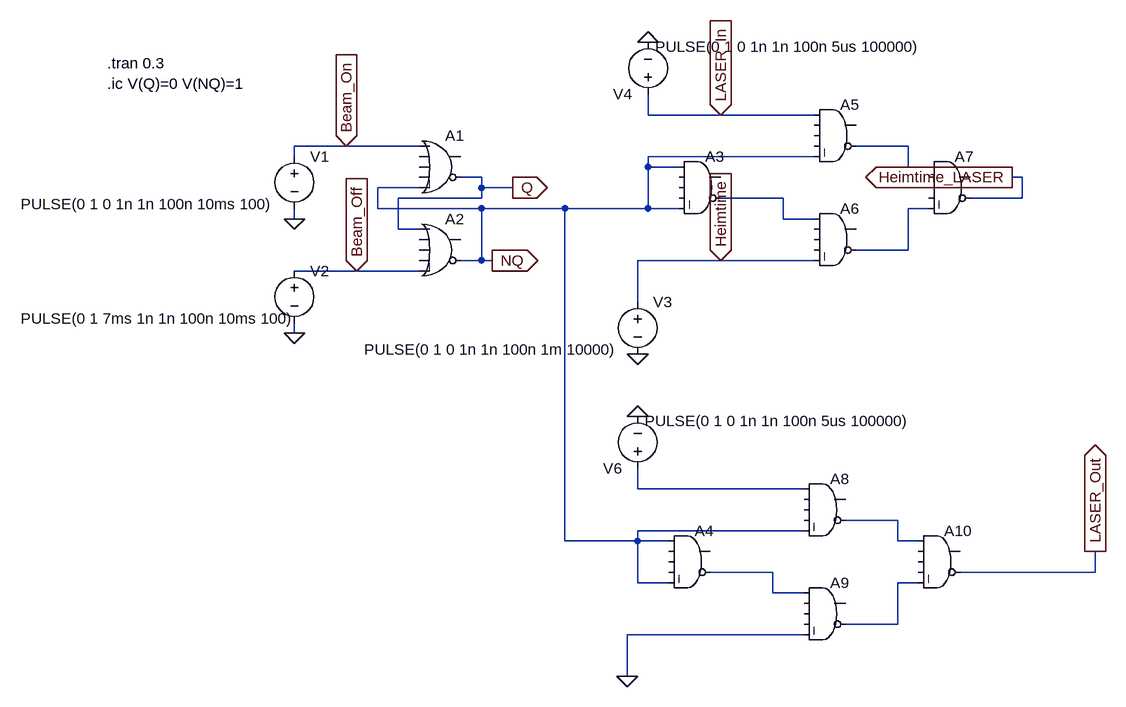
[diagram p0: schematic Draft1.asc]
Draft1.asc, the LTspice schematic file:
Version 4
SHEET 1 1288 1028
WIRE 528 64 528 32
WIRE 640 64 528 64
WIRE 784 64 640 64
WIRE 64 112 -16 112
WIRE 176 112 64 112
WIRE 928 112 848 112
WIRE -16 128 -16 112
WIRE 784 128 528 128
WIRE 528 144 528 128
WIRE 576 144 528 144
WIRE 928 144 928 112
WIRE 960 144 928 144
WIRE 272 160 240 160
WIRE 1104 160 1088 160
WIRE 176 176 112 176
WIRE 272 176 272 160
WIRE 320 176 272 176
WIRE 272 192 272 176
WIRE 272 192 144 192
WIRE 736 192 640 192
WIRE 1104 192 1104 160
WIRE 1104 192 1024 192
WIRE 112 208 112 176
WIRE 272 208 112 208
WIRE 400 208 272 208
WIRE 528 208 528 144
WIRE 528 208 400 208
WIRE 576 208 528 208
WIRE 960 208 928 208
WIRE -16 224 -16 208
WIRE 736 224 736 192
WIRE 784 224 736 224
WIRE 144 240 144 192
WIRE 176 240 144 240
WIRE 928 272 928 208
WIRE 928 272 848 272
WIRE 272 288 272 208
WIRE 272 288 240 288
WIRE 288 288 272 288
WIRE 640 288 512 288
WIRE 784 288 640 288
WIRE 80 304 -16 304
WIRE 176 304 80 304
WIRE 512 352 512 288
WIRE -16 400 -16 384
WIRE 512 640 512 608
WIRE 768 640 512 640
WIRE 912 688 832 688
WIRE 768 704 512 704
WIRE 400 720 400 208
WIRE 512 720 512 704
WIRE 512 720 400 720
WIRE 560 720 512 720
WIRE 912 720 912 688
WIRE 944 720 912 720
WIRE 720 768 624 768
WIRE 1216 768 1216 736
WIRE 1216 768 1008 768
WIRE 512 784 512 720
WIRE 560 784 512 784
WIRE 944 784 912 784
WIRE 720 800 720 768
WIRE 768 800 720 800
WIRE 912 848 912 784
WIRE 912 848 832 848
WIRE 768 864 496 864
WIRE 496 928 496 864
FLAG -16 224 0
FLAG -16 400 0
FLAG 320 176 Q
IOPIN 320 176 Out
FLAG 288 288 NQ
IOPIN 288 288 Out
FLAG 512 432 0
FLAG 528 -48 0
FLAG 1088 160 Heimtime_LASER
IOPIN 1088 160 Out
FLAG 512 528 0
FLAG 1216 736 LASER_Out
IOPIN 1216 736 Out
FLAG 496 928 0
FLAG 640 64 LASER_In
IOPIN 640 64 In
FLAG 640 288 Heimtime
IOPIN 640 288 In
FLAG 64 112 Beam_On
IOPIN 64 112 In
FLAG 80 304 Beam_Off
IOPIN 80 304 In
SYMBOL Digital\\or 208 80 R0
SYMATTR InstName A1
SYMBOL voltage -16 112 R0
WINDOW 3 -421 89 Left 2
WINDOW 123 0 0 Left 0
WINDOW 39 0 0 Left 0
SYMATTR InstName V1
SYMATTR Value PULSE(0 1 0 1n 1n 100n 10ms 100)
SYMBOL voltage -16 288 R0
WINDOW 3 -421 89 Left 2
WINDOW 123 0 0 Left 0
WINDOW 39 0 0 Left 0
SYMATTR InstName V2
SYMATTR Value PULSE(0 1 7ms 1n 1n 100n 10ms 100)
SYMBOL Digital\\or 208 208 R0
SYMATTR InstName A2
SYMBOL Digital\\and 608 112 R0
SYMATTR InstName A3
SYMBOL Digital\\and 816 32 R0
SYMATTR InstName A5
SYMBOL Digital\\and 816 192 R0
SYMATTR InstName A6
SYMBOL Digital\\and 992 112 R0
SYMATTR InstName A7
SYMBOL voltage 512 336 R0
WINDOW 3 -421 89 Left 2
WINDOW 123 0 0 Left 0
WINDOW 39 0 0 Left 0
SYMATTR InstName V3
SYMATTR Value PULSE(0 1 0 1n 1n 100n 1m 10000)
SYMBOL voltage 528 48 R180
WINDOW 3 -421 89 Left 2
WINDOW 123 0 0 Left 0
WINDOW 39 0 0 Left 0
SYMATTR InstName V4
SYMATTR Value PULSE(0 1 0 1n 1n 100n 5us 100000)
SYMBOL Digital\\and 592 688 R0
SYMATTR InstName A4
SYMBOL Digital\\and 800 608 R0
SYMATTR InstName A8
SYMBOL Digital\\and 800 768 R0
SYMATTR InstName A9
SYMBOL Digital\\and 976 688 R0
SYMATTR InstName A10
SYMBOL voltage 512 624 R180
WINDOW 3 -421 89 Left 2
WINDOW 123 0 0 Left 0
WINDOW 39 0 0 Left 0
SYMATTR InstName V6
SYMATTR Value PULSE(0 1 0 1n 1n 100n 5us 100000)
TEXT -304 -16 Left 2 !.tran 0.3
TEXT -304 16 Left 2 !.ic V(Q)=0 V(NQ)=1

The netlist it stands for:
* Draft1.asc
A1 Beam_On 0 0 0 NQ Q 0 0 OR
V1 Beam_On 0 PULSE(0 1 0 1n 1n 100n 10ms 100)
V2 Beam_Off 0 PULSE(0 1 7ms 1n 1n 100n 10ms 100)
A2 Q 0 0 0 Beam_Off NQ 0 0 OR
A3 NQ 0 0 0 NQ N002 0 0 AND
A5 LASER_In 0 0 0 NQ N001 0 0 AND
A6 N002 0 0 0 Heimtime N003 0 0 AND
A7 N001 0 0 0 N003 Heimtime_LASER 0 0 AND
V3 Heimtime 0 PULSE(0 1 0 1n 1n 100n 1m 10000)
V4 LASER_In 0 PULSE(0 1 0 1n 1n 100n 5us 100000)
A4 NQ 0 0 0 NQ N006 0 0 AND
A8 N004 0 0 0 NQ N005 0 0 AND
A9 N006 0 0 0 0 N007 0 0 AND
A10 N005 0 0 0 N007 LASER_Out 0 0 AND
V6 N004 0 PULSE(0 1 0 1n 1n 100n 5us 100000)
.tran 0.3
.ic V(Q)=0 V(NQ)=1
.backanno
.end